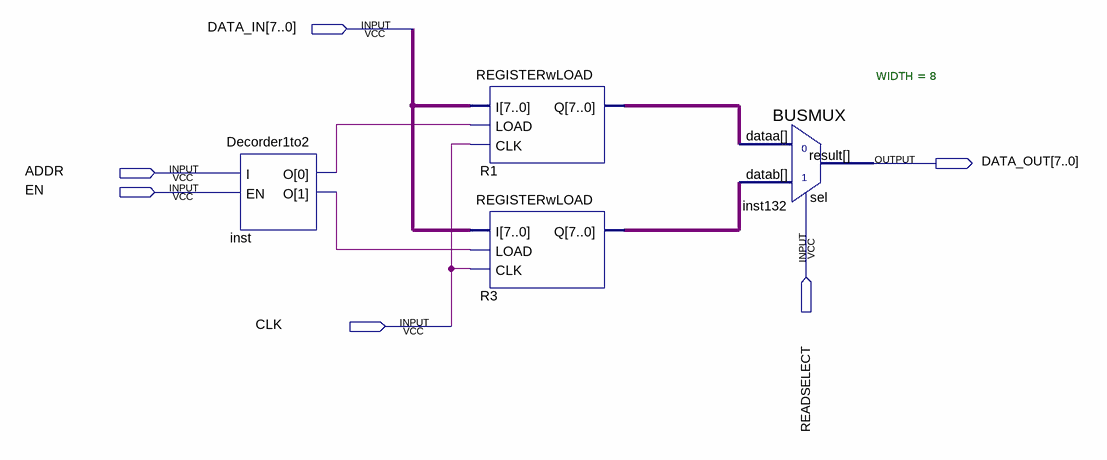
[diagram p0: schematic sheet]
// Quartus schematic REGISTER_FILES.bdf as structural Verilog: 4 symbols, 6 pins
module REGISTER_FILES (
  input  [7:0] DATA_IN,
  input  ADDR,
  input  EN,
  input  READSELECT,
  input  CLK,
  output [7:0] DATA_OUT
);

  wire inst_o, inst_o_2;
  wire [7:0] R1_q, R3_q;

  Decorder1to2 inst (.I(ADDR), .EN(EN), .O({inst_o_2, inst_o}));
  REGISTERwLOAD R1 (.I(DATA_IN), .LOAD(inst_o), .CLK(CLK), .Q(R1_q));
  REGISTERwLOAD R3 (.I(DATA_IN), .LOAD(inst_o_2), .CLK(CLK), .Q(R3_q));
  BUSMUX #(.WIDTH(8)) inst132 (.datab(R3_q), .sel(READSELECT), .dataa(R1_q), .result(DATA_OUT));
endmodule
